# Altium project OBATS.PrjPcb
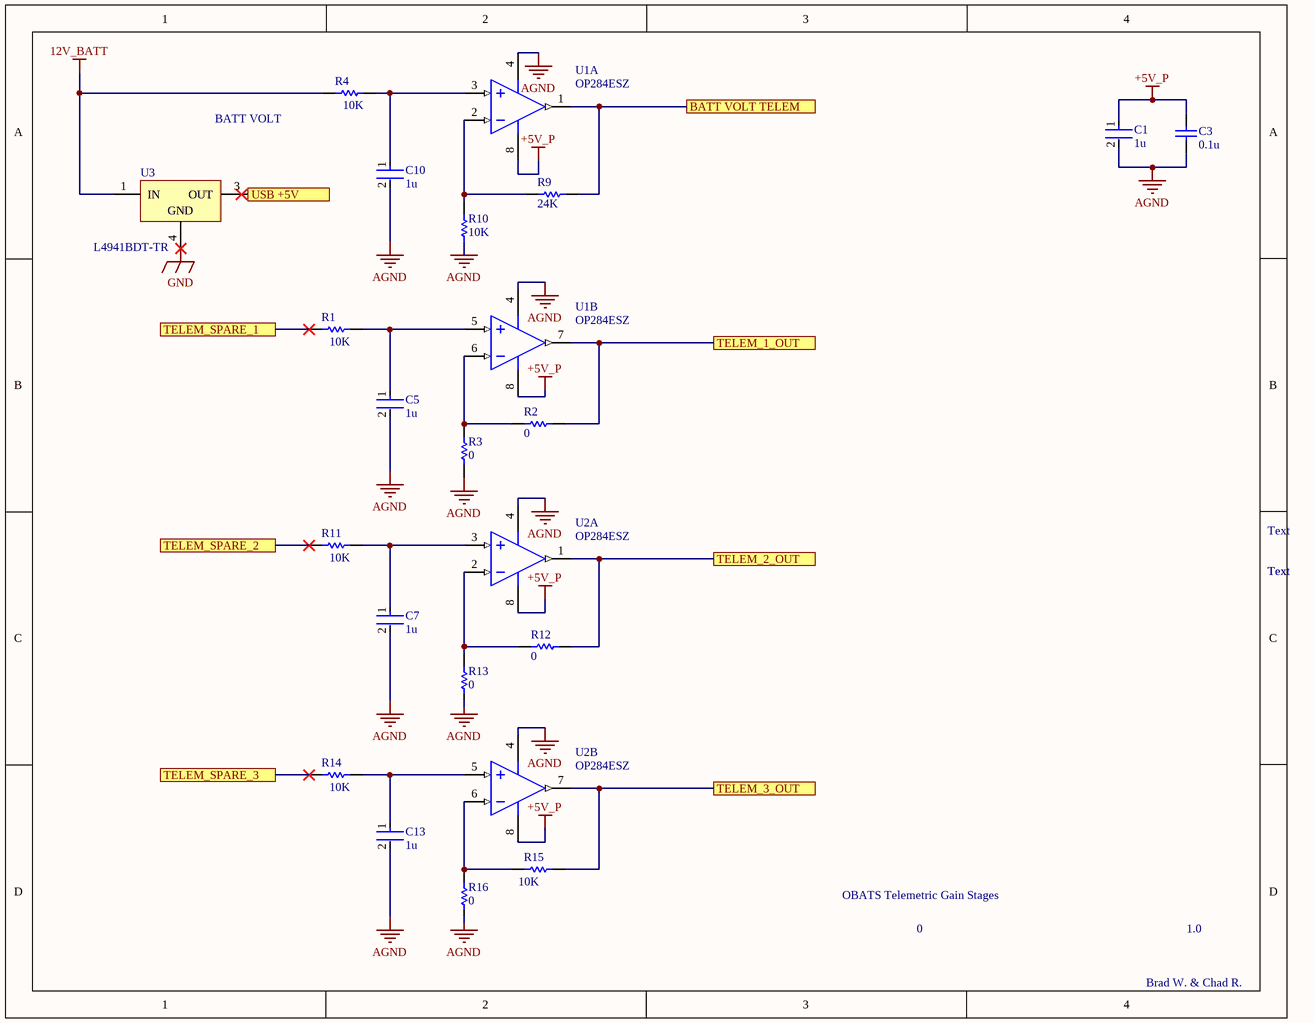
[diagram p0: Analog_Telem.SchDoc]
3 sheets, 35 parts. Net scope: flat (ports and power ports of the same name join across sheets).
Board file: tmp235_Front_End_Siognal_Chain.PcbDoc
Sheets:
  Analog_Telem.SchDoc
  Gyro Accel Temp MPU6050.SchDoc
  ADC_MCP3008.SchDoc

## Sheet Analog_Telem.SchDoc
size A

### Parts
C1  1u  [FP-CL31-IPC_B]
C3  0.1u  [CAPC1206(3216)130_M]
C5  1u  [FP-CL31-IPC_B]
C7  1u  [FP-CL31-IPC_B]
C10  1u  [FP-CL31-IPC_B]
C13  1u  [FP-CL31-IPC_B]
R1  10K  [RESC3116X65X45ML10T20]
R2  0  [RESC3116X65X45ML10T20]
R3  0  [RESC3116X65X45ML10T20]
R4  10K  [RESC3116X65X45ML10T20]
R9  24K  [RESC2013X70X40ML20T20]
R10  10K  [RESC3116X65X45ML10T20]
R11  10K  [RESC3116X65X45ML10T20]
R12  0  [RESC3116X65X45ML10T20]
R13  0  [RESC3116X65X45ML10T20]
R14  10K  [RESC3116X65X45ML10T20]
R15  10K  [RESC3116X65X45ML10T20]
R16  0  [RESC3116X65X45ML10T20]
U1  OP284ESZ  [ADI-R-8_L]  (parts A,B of 2)
U2  OP284ESZ  [ADI-R-8_L]  (parts A,B of 2)
U3  L4941BDT-TR  [TO-252_L]

### Ports
BATT VOLT TELEM, TELEM_1_OUT, TELEM_2_OUT, TELEM_3_OUT, TELEM_SPARE_1, TELEM_SPARE_2, TELEM_SPARE_3, USB +5V

### Nets
12V_BATT: R4.1 U3.1(IN)
+5V_P: C1.1 C3.2 U1.8(+V) U2.8(+V)
AGND: C1.2 C3.1 C5.2 C7.2 C10.2 C13.2 R3.1 R10.1 R13.1 R16.1 U1.4(-V) U2.4(-V)
GND: U3.4(GND)
NetC5_1: C5.1 R1.2 U1.5(+IN_B)
NetC7_1: C7.1 R11.2 U2.3(+IN_A)
NetC10_1: C10.1 R4.2 U1.3(+IN_A)
NetC13_1: C13.1 R14.2 U2.5(+IN_B)
NetR1_1: R1.1 ; port TELEM_SPARE_1
NetR2_1: R2.1 U1.7(OUT_B) ; port TELEM_1_OUT
NetR2_2: R2.2 R3.2 U1.6(-IN_B)
NetR9_1: R9.1 R10.2 U1.2(-IN_A)
NetR9_2: R9.2 U1.1(OUT_A) ; port BATT VOLT TELEM
NetR11_1: R11.1 ; port TELEM_SPARE_2
NetR12_1: R12.1 U2.1(OUT_A) ; port TELEM_2_OUT
NetR12_2: R12.2 R13.2 U2.2(-IN_A)
NetR14_1: R14.1 ; port TELEM_SPARE_3
NetR15_1: R15.1 U2.7(OUT_B) ; port TELEM_3_OUT
NetR15_2: R15.2 R16.2 U2.6(-IN_B)
NetU3_3: U3.3(OUT) ; port USB +5V

### Notes on the sheet
- BATT VOLT
- Text
- OBATS Telemetric Gain Stages
- 0
- 1.0
- Brad W. & Chad R.

### Library data of the parts
C1 C5 C7 C10 C13 = CMP-13271-001662-1: Cap Ceramic 1uF 50V X7R ±10% SMD 1206 +125°C Embossed T/R; Case Code (Metric): 3216; Packaging: Tape and Reel; Depth: 1.6mm; Max Operating Temperature: 125°C; Length: 3.2mm; Contact Plating: Tin; Voltage Rating (DC): 50V; Radiation Hardening: No; Min Operating Temperature: -55°C; Dielectric: X7R; Voltage: 50V; Lead Free: Lead Free; Capacitance: 1uF; Package Quantity: 1; Material: Ceramic; Thickness: 0.071inch; Width: 0.063inch; Voltage Rating: 50V; Case Code (Imperial): 1206; Mount: Surface Mount; Case/Package: 1206; Tolerance: 10%; Height: 1.6mm
C3 = CMP-1037-04215-1: CAP 100nF 100V ±20% 1206 (3216 Metric) Thickness 1.3mm SMD; Case-EIA: 1206; Tolerance: Â±20%; Case-Metric: 3216; Rated Voltage: 100 V; Max Thickness: 1.3 mm; Technology: SMT; Value: 100nF
R1-R4 R10-R16 = CMP-2003-04910-1: Manufacturer: Yageo; Part Number: AC1206FR-0710KL
R9 = CMP-2001-00525-1: Manufacturer: Panasonic; Part Number: ERJ6ENF2402V
U1 U2 = CMP-0384-00701-1: Double Channel Single-Supply Operation Operational Amplifier, 4.25 MHz BW, 4 V/us SR, Industrial, 8-pin SOIC (R-8), Tube; Generic Part Number: OP284; Manufacturer: Analog Devices; Slew Rate: 4V/us; Amplifiers Per Package: 2; Input Offset Voltage: 175uV; V Span Max: 36V; Iq/Amp: 2mA; V Span Min: 3V; Input Bias Current: 80nA; ComponentLink1URL: http://www.analog.com/en/index.html; PackageReference: R-8; Code_JEDEC: MS-012-AA; Small Signal Bandwidth: 4.25MHz; DatasheetVersion: Rev. J; PackageDescription: 8-Pin Standard Small Outline Package, Body 3.9 x 4.9 mm, Pitch 1.27 mm; ComponentLink3Description: Package Specification; PackageVersion: 060506-A; ComponentLink2Description: Datasheet; ComponentLink3URL: http://www.analog.com/static/imported-files/packages/PKG_PDF/SOIC_Narrow%20(R)/R_8.pdf; Mounting Technology: Surface Mount; ComponentLink2URL: http://www.analog.com/static/imported-files/data_sheets/OP184_284_484.pdf; PartNumber: OP284ESZ; ComponentLink1Description: Manufacturer URL
U3 = CMP-0244-00200-1: 1A Very Low Drop Regulator, 3-Pin DPAK, Tape and Reel; PackageDescription: 3-Pin Transistor Outline Package 2.28 mm Pitch, 9.7 mm Lead Span (DPAK); ComponentLink2URL: http://www.st.com/internet/com/TECHNICAL_RESOURCES/TECHNICAL_LITERATURE/DATASHEET/CD00000443.pdf; ComponentLink1URL: http://www.st.com; DatasheetVersion: 15/09/2006; PackageReference: TO-252; PackageVersion: 2011; ComponentLink2Description: Datasheet; ComponentLink1Description: Manufacturer URL

## Sheet Gyro Accel Temp MPU6050.SchDoc
size A
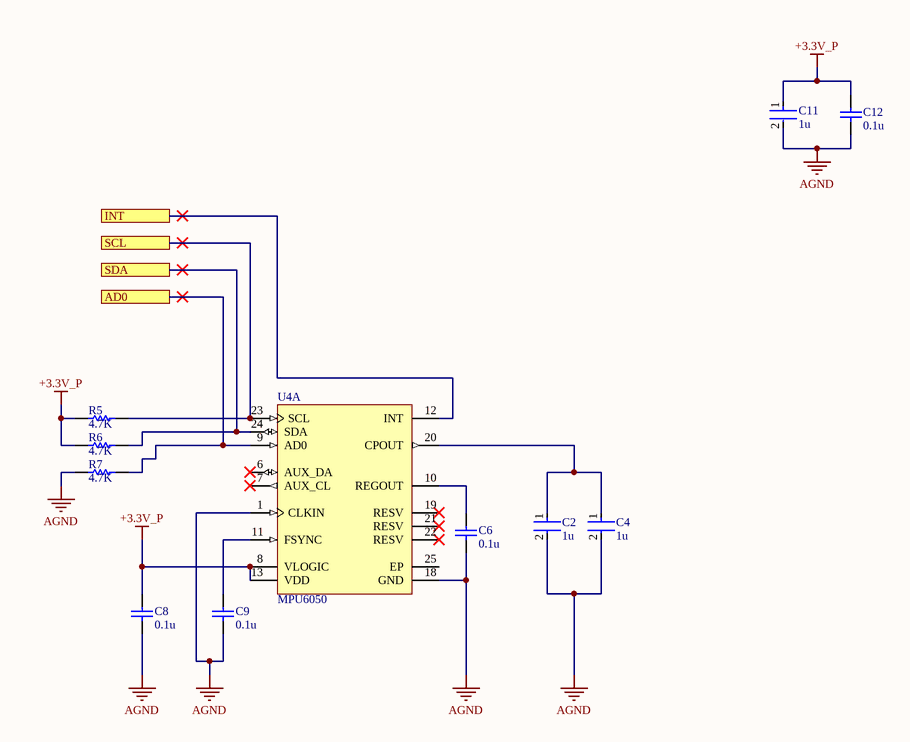
[diagram p1: Gyro Accel Temp MPU6050.SchDoc]

### Parts
C2  1u  [FP-CL31-IPC_B]
C4  1u  [FP-CL31-IPC_B]
C6  0.1u  [CAPC1206(3216)130_M]
C8  0.1u  [CAPC1206(3216)130_M]
C9  0.1u  [CAPC1206(3216)130_M]
C11  1u  [FP-CL31-IPC_B]
C12  0.1u  [CAPC1206(3216)130_M]
R5  4.7K  [RESC3216X70X50LL05T20]
R6  4.7K  [RESC3216X70X50LL05T20]
R7  4.7K  [RESC3216X70X50LL05T20]
U4  MPU6050  [INSE-QFN-24_V]  (part A of 2)

### Ports
AD0, INT, SCL, SDA

### Nets
+3.3V_P: C8.2 C11.1 C12.2 R5.1 R6.1 U4.8(VLOGIC) U4.13(VDD)
AGND: C2.2 C4.2 C6.1 C8.1 C9.1 C11.2 C12.1 R7.1 U4.1(CLKIN) U4.18(GND)
NetC2_1: C2.1 C4.1 U4.20(CPOUT)
NetC6_2: C6.2 U4.10(REGOUT)
NetC9_2: C9.2 U4.11(FSYNC)
NetR5_2: R5.2 U4.23(SCL) ; port SCL
NetR6_2: R6.2 U4.24(SDA) ; port SDA
NetR7_2: R7.2 U4.9(AD0) ; port AD0
NetU4_12: U4.12(INT) ; port INT

Not connected (* = marked no-connect by the designer): U4 6(AUX_DA)* 7(AUX_CL)* 19(RESV)* 21(RESV)* 22(RESV)* 25(EP)

### Library data of the parts
C2 C4 C11 = CMP-13271-001662-1: as C1 on sheet Analog_Telem; Case Code (Metric): 3216; Packaging: Tape and Reel; Depth: 1.6mm; Max Operating Temperature: 125°C; Length: 3.2mm; Contact Plating: Tin; Voltage Rating (DC): 50V; Radiation Hardening: No; Min Operating Temperature: -55°C; Dielectric: X7R; Voltage: 50V; Lead Free: Lead Free; Capacitance: 1uF; Package Quantity: 1; Material: Ceramic; Thickness: 0.071inch; Width: 0.063inch; Voltage Rating: 50V; Case Code (Imperial): 1206; Mount: Surface Mount; Case/Package: 1206; Tolerance: 10%; Height: 1.6mm
C6 C8 C9 C12 = CMP-1037-04215-1: as C3 on sheet Analog_Telem; Rated Voltage: 100 V; Max Thickness: 1.3 mm; Technology: SMT; Value: 100nF
R5-R7 = CMP-2003-00848-1: Part Number: ERJ8ENF4701V; Manufacturer: Panasonic
U4 = CMP-1753-00002-1: 3-Axis Gyroscope, 3-Axis Accelerometer / , 2.375 to 3.46 V, -40 to 105 degC, 24-Pin QFN, RoHS, Tape and Reel; Resistance: 5.6 kohm; Tolerance: 1%; Voltage Rating: 75 V; Power Rating: 100 mW; ComponentLink1Description: Manufacturer URL; Mount: Surface Mount; Max Operating Temperature: 155degC; Package Quantity: 5000; ComponentLink2Description: Datasheet; Pins: 2; Packaging: Tape and Reel; Case Code (Imperial): 0603; PackageReference: QFN-24; ComponentLink2URL: https://datasheet.ciiva.com/1513/1788002-1513632.pdf; Radiation Hardening: No; ComponentLink1URL: http://www.invensense.com/; PackageDescription: 24-Pin Quad Flat No-lead Package, Body 4 x 4 mm, Pitch 0.5 mm; Height: 0.45 mm; Case/Package: 0603; Case Code (Metric): 1608; REACH SVHC: Yes; Min Operating Temperature: -55degC; DatasheetVersion: Rev. 3.4, 08/2013; Width: 0.8 mm; RoHSCompliant: True; Length: 1.6 mm

## Sheet ADC_MCP3008.SchDoc
size A
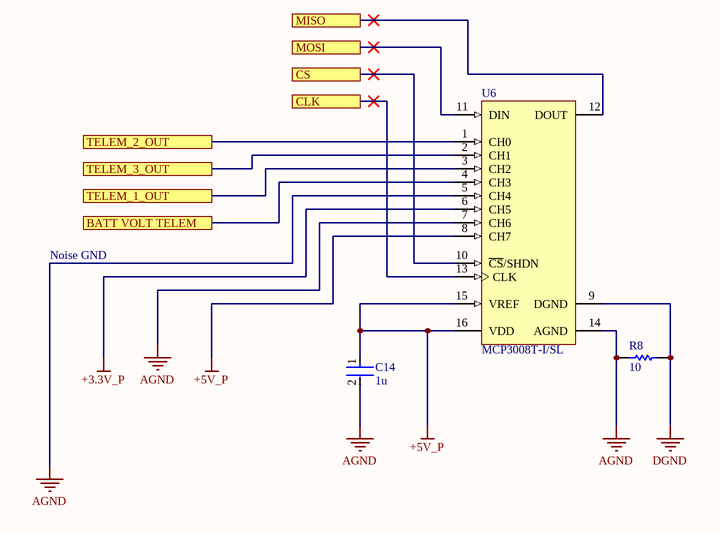
[diagram p2: ADC_MCP3008.SchDoc]

### Parts
C14  1u  [FP-CL31-IPC_B]
R8  10  [RESC3216X60X45ML10T20]
U6  MCP3008T-I/SL  [SOIC-SL16_N]

### Ports
BATT VOLT TELEM, CLK, CS, MISO, MOSI, TELEM_1_OUT, TELEM_2_OUT, TELEM_3_OUT

### Nets
+3.3V_P: U6.6(CH5)
+5V_P: C14.1 U6.8(CH7) U6.15(VREF) U6.16(VDD)
AGND: C14.2 R8.1 U6.5(CH4) U6.7(CH6) U6.14(AGND)
DGND: R8.2 U6.9(DGND)
NetR2_1: U6.3(CH2) ; port TELEM_1_OUT
NetR9_2: U6.4(CH3) ; port BATT VOLT TELEM
NetR12_1: U6.1(CH0) ; port TELEM_2_OUT
NetR15_1: U6.2(CH1) ; port TELEM_3_OUT
NetU6_10: U6.10(~{CS}/SHDN) ; port CS
NetU6_11: U6.11(DIN) ; port MOSI
NetU6_12: U6.12(DOUT) ; port MISO
NetU6_13: U6.13(CLK) ; port CLK

### Notes on the sheet
- Noise GND

### Library data of the parts
C14 = CMP-13271-001662-1: as C1 on sheet Analog_Telem; Case Code (Metric): 3216; Packaging: Tape and Reel; Depth: 1.6mm; Max Operating Temperature: 125°C; Length: 3.2mm; Contact Plating: Tin; Voltage Rating (DC): 50V; Radiation Hardening: No; Min Operating Temperature: -55°C; Dielectric: X7R; Voltage: 50V; Lead Free: Lead Free; Capacitance: 1uF; Package Quantity: 1; Material: Ceramic; Thickness: 0.071inch; Width: 0.063inch; Voltage Rating: 50V; Case Code (Imperial): 1206; Mount: Surface Mount; Case/Package: 1206; Tolerance: 10%; Height: 1.6mm
R8 = CMP-2003-04815-1: Manufacturer: Vishay Dale; Part Number: CRCW120610R0FKEA
U6 = CMP-0188-00351-2: 2.7V 4-Channel/8-Channel 10-Bit A/D Converters with SPI Serial Interface, 16-Pin SOIC 150mil, Industrial Temperature, Tape and Reel; ComponentLink2Description: Datasheet; Code_JEDEC: MS-012-AC; Code_IPC: SOIC127P600-16; ComponentLink1Description: Manufacturer URL; DatasheetVersion: revD, Dec-2008; PackageReference: SOIC-SL16; ComponentLink2URL: http://ww1.microchip.com/downloads/en/DeviceDoc/21295d.pdf; ComponentLink3Description: Package Specification; ComponentLink3URL: http://www.microchip.com/stellent/groups/techpub_sg/documents/packagingspec/en012702.pdf; PackageVersion: revBB, Aug-2009; RevisionNote: URLs added.; PackageDescription: 16-Lead Plastic Small Outline (SL) - Narrow, 3.90mm Body [SOIC]; ComponentLink1URL: http://www.microchip.com/

## Nets that join several sheets
+3.3V_P: Gyro Accel Temp MPU6050 (7 pins), ADC_MCP3008 (U6.6)
+5V_P: Analog_Telem (C1.1 C3.2 U1.8 U2.8), ADC_MCP3008 (C14.1 U6.8 U6.15 U6.16)
AGND: Analog_Telem (12 pins), Gyro Accel Temp MPU6050 (10 pins), ADC_MCP3008 (5 pins)
NetR2_1: Analog_Telem (R2.1 U1.7), ADC_MCP3008 (U6.3)
NetR9_2: Analog_Telem (R9.2 U1.1), ADC_MCP3008 (U6.4)
NetR12_1: Analog_Telem (R12.1 U2.1), ADC_MCP3008 (U6.1)
NetR15_1: Analog_Telem (R15.1 U2.7), ADC_MCP3008 (U6.2)